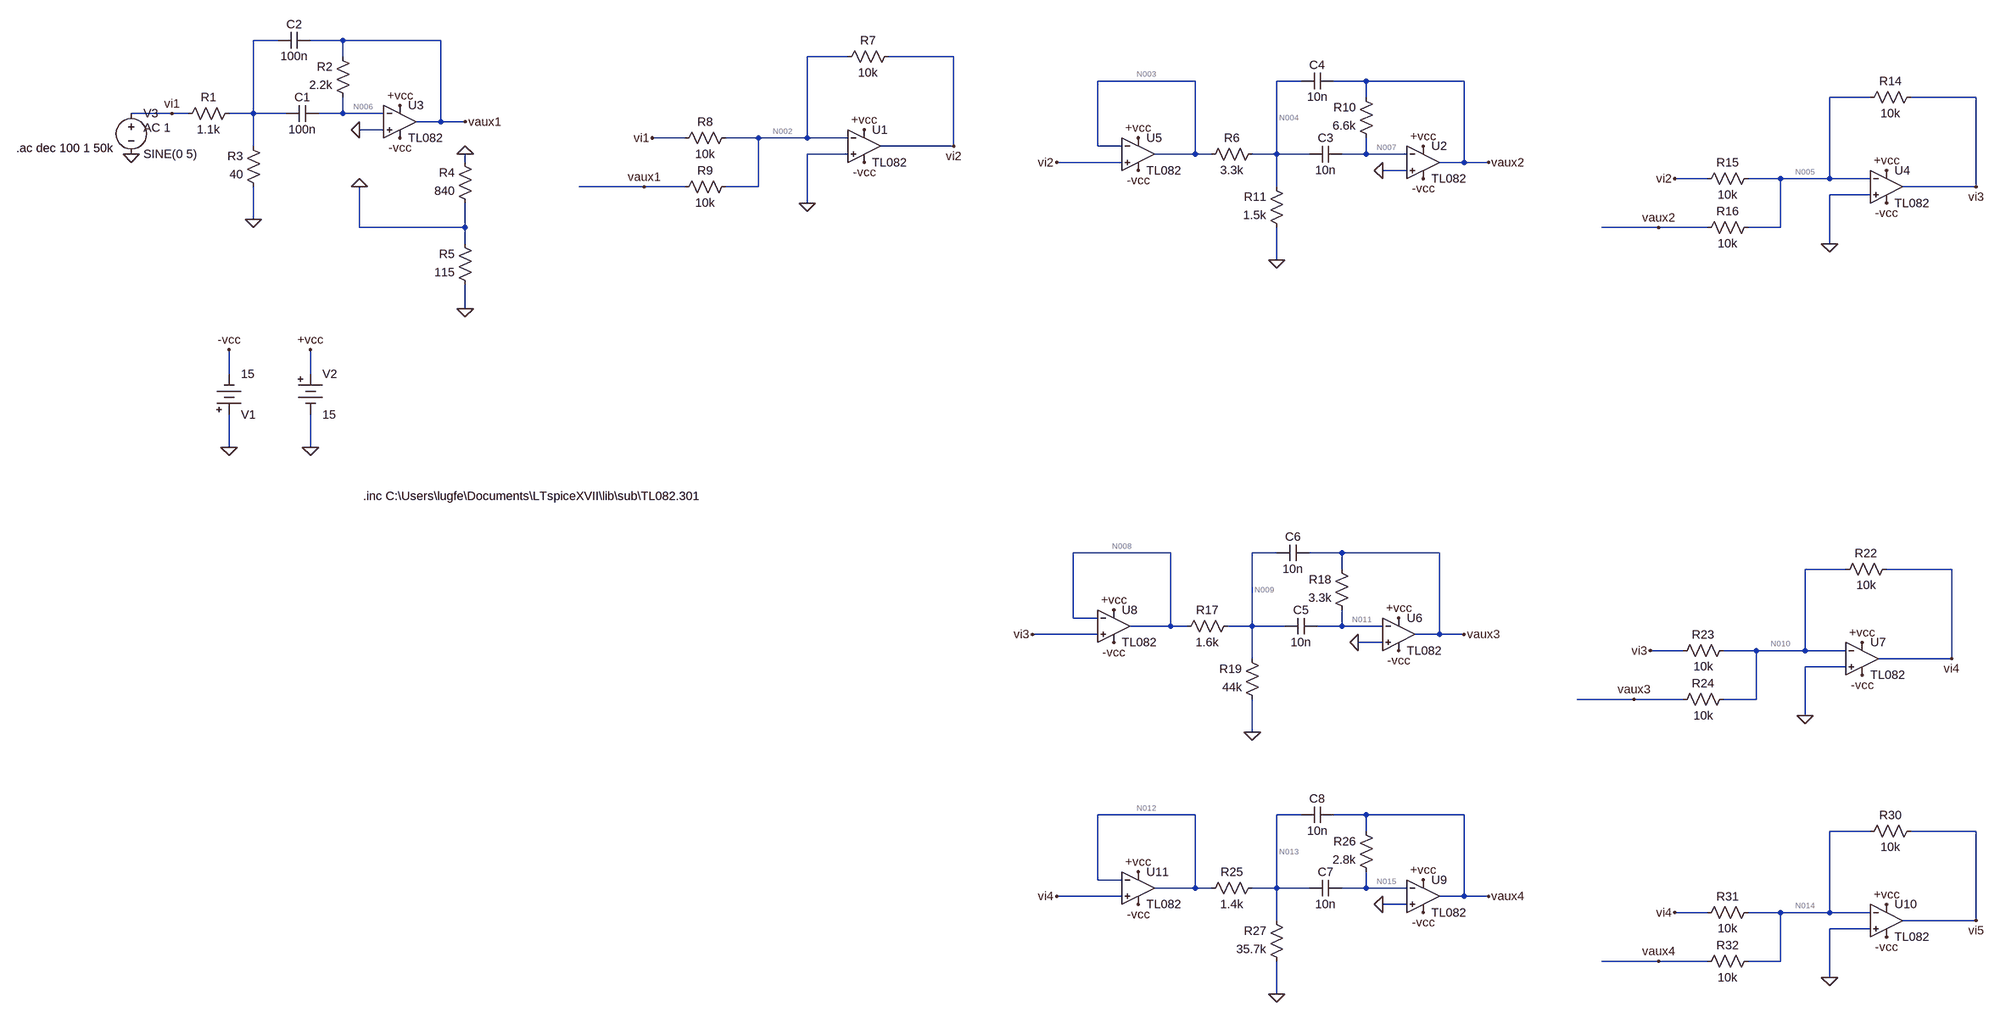
[diagram p0: schematic simulacion.asc]
simulacion.asc, the LTspice schematic file:
Version 4
SHEET 1 3120 2004
WIRE -704 -352 -752 -352
WIRE -576 -352 -640 -352
WIRE -384 -352 -576 -352
WIRE -576 -320 -576 -352
WIRE 416 -320 336 -320
WIRE 624 -320 496 -320
WIRE 1552 -272 1360 -272
WIRE 1760 -272 1712 -272
WIRE 1888 -272 1824 -272
WIRE 2080 -272 1888 -272
WIRE 1888 -240 1888 -272
WIRE 2880 -240 2800 -240
WIRE 3088 -240 2960 -240
WIRE -912 -208 -992 -208
WIRE -880 -208 -912 -208
WIRE -752 -208 -752 -352
WIRE -752 -208 -800 -208
WIRE -688 -208 -752 -208
WIRE -576 -208 -576 -240
WIRE -576 -208 -624 -208
WIRE -496 -208 -576 -208
WIRE -384 -192 -384 -352
WIRE -384 -192 -432 -192
WIRE -336 -192 -384 -192
WIRE -496 -176 -544 -176
WIRE 96 -160 32 -160
WIRE 240 -160 176 -160
WIRE 336 -160 336 -320
WIRE 336 -160 240 -160
WIRE 416 -160 336 -160
WIRE -752 -144 -752 -208
WIRE 624 -144 624 -320
WIRE 624 -144 480 -144
WIRE 1360 -144 1360 -272
WIRE 1408 -144 1360 -144
WIRE 416 -128 336 -128
WIRE 1552 -128 1552 -272
WIRE 1552 -128 1472 -128
WIRE 1584 -128 1552 -128
WIRE 1712 -128 1712 -272
WIRE 1712 -128 1664 -128
WIRE 1776 -128 1712 -128
WIRE 1888 -128 1888 -160
WIRE 1888 -128 1840 -128
WIRE 1968 -128 1888 -128
WIRE -336 -112 -336 -128
WIRE 1408 -112 1280 -112
WIRE 2080 -112 2080 -272
WIRE 2080 -112 2032 -112
WIRE 2128 -112 2080 -112
WIRE 1968 -96 1920 -96
WIRE 2560 -80 2496 -80
WIRE 2704 -80 2640 -80
WIRE 2800 -80 2800 -240
WIRE 2800 -80 2704 -80
WIRE 2880 -80 2800 -80
WIRE 16 -64 -112 -64
WIRE 96 -64 16 -64
WIRE 240 -64 240 -160
WIRE 240 -64 176 -64
WIRE 1712 -64 1712 -128
WIRE 3088 -64 3088 -240
WIRE 3088 -64 2944 -64
WIRE 2880 -48 2800 -48
WIRE 336 -32 336 -128
WIRE -752 0 -752 -64
WIRE -544 16 -544 -64
WIRE -336 16 -336 -32
WIRE -336 16 -544 16
WIRE 2464 16 2352 16
WIRE 2560 16 2464 16
WIRE 2704 16 2704 -80
WIRE 2704 16 2640 16
WIRE -336 48 -336 16
WIRE 2800 48 2800 -48
WIRE 1712 80 1712 16
WIRE -336 176 -336 128
WIRE -800 304 -800 256
WIRE -640 304 -640 256
WIRE -800 448 -800 384
WIRE -640 448 -640 384
WIRE 1504 656 1312 656
WIRE 1712 656 1664 656
WIRE 1840 656 1776 656
WIRE 2032 656 1840 656
WIRE 1840 688 1840 656
WIRE 2832 688 2752 688
WIRE 3040 688 2912 688
WIRE 1312 784 1312 656
WIRE 1360 784 1312 784
WIRE 1504 800 1504 656
WIRE 1504 800 1424 800
WIRE 1536 800 1504 800
WIRE 1664 800 1664 656
WIRE 1664 800 1616 800
WIRE 1728 800 1664 800
WIRE 1840 800 1840 768
WIRE 1840 800 1792 800
WIRE 1920 800 1840 800
WIRE 1360 816 1232 816
WIRE 2032 816 2032 656
WIRE 2032 816 1984 816
WIRE 2080 816 2032 816
WIRE 1920 832 1872 832
WIRE 2512 848 2448 848
WIRE 2656 848 2592 848
WIRE 2752 848 2752 688
WIRE 2752 848 2656 848
WIRE 2832 848 2752 848
WIRE 1664 864 1664 800
WIRE 3040 864 3040 688
WIRE 3040 864 2896 864
WIRE 2832 880 2752 880
WIRE 2416 944 2304 944
WIRE 2512 944 2416 944
WIRE 2656 944 2656 848
WIRE 2656 944 2592 944
WIRE 2752 976 2752 880
WIRE 1664 1008 1664 944
WIRE 1552 1456 1360 1456
WIRE 1760 1456 1712 1456
WIRE 1888 1456 1824 1456
WIRE 2080 1456 1888 1456
WIRE 1888 1488 1888 1456
WIRE 2880 1488 2800 1488
WIRE 3088 1488 2960 1488
WIRE 1360 1584 1360 1456
WIRE 1408 1584 1360 1584
WIRE 1552 1600 1552 1456
WIRE 1552 1600 1472 1600
WIRE 1584 1600 1552 1600
WIRE 1712 1600 1712 1456
WIRE 1712 1600 1664 1600
WIRE 1776 1600 1712 1600
WIRE 1888 1600 1888 1568
WIRE 1888 1600 1840 1600
WIRE 1968 1600 1888 1600
WIRE 1408 1616 1280 1616
WIRE 2080 1616 2080 1456
WIRE 2080 1616 2032 1616
WIRE 2128 1616 2080 1616
WIRE 1968 1632 1920 1632
WIRE 2560 1648 2496 1648
WIRE 2704 1648 2640 1648
WIRE 2800 1648 2800 1488
WIRE 2800 1648 2704 1648
WIRE 2880 1648 2800 1648
WIRE 1712 1664 1712 1600
WIRE 3088 1664 3088 1488
WIRE 3088 1664 2944 1664
WIRE 2880 1680 2800 1680
WIRE 2464 1744 2352 1744
WIRE 2560 1744 2464 1744
WIRE 2704 1744 2704 1648
WIRE 2704 1744 2640 1744
WIRE 2800 1776 2800 1680
WIRE 1712 1808 1712 1744
FLAG -640 256 +vcc
FLAG -640 448 0
FLAG -800 256 -vcc
FLAG -800 448 0
FLAG -336 176 0
FLAG -752 0 0
FLAG -992 -128 0
FLAG -464 -160 -vcc
FLAG -464 -224 +vcc
FLAG -336 -192 vaux1
FLAG -912 -208 vi1
FLAG 336 -32 0
FLAG 448 -112 -vcc
FLAG 448 -176 +vcc
FLAG 32 -160 vi1
FLAG -544 -64 0
FLAG -336 -128 0
FLAG -544 -176 0
FLAG 16 -64 vaux1
FLAG 1712 80 0
FLAG 2000 -80 -vcc
FLAG 2000 -144 +vcc
FLAG 2800 48 0
FLAG 2912 -32 -vcc
FLAG 2912 -96 +vcc
FLAG 1920 -96 0
FLAG 1440 -96 -vcc
FLAG 1440 -160 +vcc
FLAG 1280 -112 vi2
FLAG 2496 -80 vi2
FLAG 2128 -112 vaux2
FLAG 2464 16 vaux2
FLAG 624 -144 vi2
FLAG 3088 -64 vi3
FLAG 1664 1008 0
FLAG 1952 848 -vcc
FLAG 1952 784 +vcc
FLAG 2752 976 0
FLAG 2864 896 -vcc
FLAG 2864 832 +vcc
FLAG 1872 832 0
FLAG 1392 832 -vcc
FLAG 1392 768 +vcc
FLAG 1232 816 vi3
FLAG 2448 848 vi3
FLAG 2080 816 vaux3
FLAG 2416 944 vaux3
FLAG 3040 864 vi4
FLAG 1712 1808 0
FLAG 2000 1648 -vcc
FLAG 2000 1584 +vcc
FLAG 2800 1776 0
FLAG 2912 1696 -vcc
FLAG 2912 1632 +vcc
FLAG 1920 1632 0
FLAG 1440 1632 -vcc
FLAG 1440 1568 +vcc
FLAG 1280 1616 vi4
FLAG 2496 1648 vi4
FLAG 2128 1616 vaux4
FLAG 2464 1744 vaux4
FLAG 3088 1664 vi5
SYMBOL Misc\\battery -640 288 R0
WINDOW 123 0 0 Left 0
WINDOW 39 0 0 Left 0
SYMATTR InstName V2
SYMATTR Value 15
SYMBOL Misc\\battery -800 400 M180
WINDOW 123 0 0 Left 0
WINDOW 39 0 0 Left 0
SYMATTR InstName V1
SYMATTR Value 15
SYMBOL Opamps\\opamp2 -464 -256 R0
SYMATTR InstName U3
SYMATTR Value TL082
SYMBOL cap -624 -224 R90
WINDOW 0 0 32 VBottom 2
WINDOW 3 32 32 VTop 2
SYMATTR InstName C1
SYMATTR Value 100n
SYMBOL cap -640 -368 R90
WINDOW 0 0 32 VBottom 2
WINDOW 3 32 32 VTop 2
SYMATTR InstName C2
SYMATTR Value 100n
SYMBOL res -784 -224 R90
WINDOW 0 0 56 VBottom 2
WINDOW 3 32 56 VTop 2
SYMATTR InstName R1
SYMATTR Value 1.1k
SYMBOL res -560 -224 R180
WINDOW 0 36 76 Left 2
WINDOW 3 36 40 Left 2
SYMATTR InstName R2
SYMATTR Value 2.2k
SYMBOL res -736 -48 R180
WINDOW 0 36 76 Left 2
WINDOW 3 36 40 Left 2
SYMATTR InstName R3
SYMATTR Value 40
SYMBOL res -320 -16 R180
WINDOW 0 36 76 Left 2
WINDOW 3 36 40 Left 2
SYMATTR InstName R4
SYMATTR Value 840
SYMBOL res -320 144 R180
WINDOW 0 36 76 Left 2
WINDOW 3 36 40 Left 2
SYMATTR InstName R5
SYMATTR Value 115
SYMBOL voltage -992 -224 R0
WINDOW 123 24 44 Left 2
WINDOW 39 0 0 Left 0
SYMATTR InstName V3
SYMATTR Value SINE(0 5)
SYMATTR Value2 AC 1
SYMBOL Opamps\\opamp2 448 -208 R0
SYMATTR InstName U1
SYMATTR Value TL082
SYMBOL res 512 -336 R90
WINDOW 0 0 56 VBottom 2
WINDOW 3 32 56 VTop 2
SYMATTR InstName R7
SYMATTR Value 10k
SYMBOL res 192 -176 R90
WINDOW 0 0 56 VBottom 2
WINDOW 3 32 56 VTop 2
SYMATTR InstName R8
SYMATTR Value 10k
SYMBOL res 192 -80 R90
WINDOW 0 0 56 VBottom 2
WINDOW 3 32 56 VTop 2
SYMATTR InstName R9
SYMATTR Value 10k
SYMBOL Opamps\\opamp2 2000 -176 R0
SYMATTR InstName U2
SYMATTR Value TL082
SYMBOL cap 1840 -144 R90
WINDOW 0 0 32 VBottom 2
WINDOW 3 32 32 VTop 2
SYMATTR InstName C3
SYMATTR Value 10n
SYMBOL cap 1824 -288 R90
WINDOW 0 0 32 VBottom 2
WINDOW 3 32 32 VTop 2
SYMATTR InstName C4
SYMATTR Value 10n
SYMBOL res 1680 -144 R90
WINDOW 0 0 56 VBottom 2
WINDOW 3 32 56 VTop 2
SYMATTR InstName R6
SYMATTR Value 3.3k
SYMBOL res 1904 -144 R180
WINDOW 0 36 76 Left 2
WINDOW 3 36 40 Left 2
SYMATTR InstName R10
SYMATTR Value 6.6k
SYMBOL res 1728 32 R180
WINDOW 0 36 76 Left 2
WINDOW 3 36 40 Left 2
SYMATTR InstName R11
SYMATTR Value 1.5k
SYMBOL Opamps\\opamp2 2912 -128 R0
SYMATTR InstName U4
SYMATTR Value TL082
SYMBOL res 2976 -256 R90
WINDOW 0 0 56 VBottom 2
WINDOW 3 32 56 VTop 2
SYMATTR InstName R14
SYMATTR Value 10k
SYMBOL res 2656 -96 R90
WINDOW 0 0 56 VBottom 2
WINDOW 3 32 56 VTop 2
SYMATTR InstName R15
SYMATTR Value 10k
SYMBOL res 2656 0 R90
WINDOW 0 0 56 VBottom 2
WINDOW 3 32 56 VTop 2
SYMATTR InstName R16
SYMATTR Value 10k
SYMBOL Opamps\\opamp2 1440 -192 R0
SYMATTR InstName U5
SYMATTR Value TL082
SYMBOL Opamps\\opamp2 1952 752 R0
SYMATTR InstName U6
SYMATTR Value TL082
SYMBOL cap 1792 784 R90
WINDOW 0 0 32 VBottom 2
WINDOW 3 32 32 VTop 2
SYMATTR InstName C5
SYMATTR Value 10n
SYMBOL cap 1776 640 R90
WINDOW 0 0 32 VBottom 2
WINDOW 3 32 32 VTop 2
SYMATTR InstName C6
SYMATTR Value 10n
SYMBOL res 1632 784 R90
WINDOW 0 0 56 VBottom 2
WINDOW 3 32 56 VTop 2
SYMATTR InstName R17
SYMATTR Value 1.6k
SYMBOL res 1856 784 R180
WINDOW 0 36 76 Left 2
WINDOW 3 36 40 Left 2
SYMATTR InstName R18
SYMATTR Value 3.3k
SYMBOL res 1680 960 R180
WINDOW 0 36 76 Left 2
WINDOW 3 36 40 Left 2
SYMATTR InstName R19
SYMATTR Value 44k
SYMBOL Opamps\\opamp2 2864 800 R0
SYMATTR InstName U7
SYMATTR Value TL082
SYMBOL res 2928 672 R90
WINDOW 0 0 56 VBottom 2
WINDOW 3 32 56 VTop 2
SYMATTR InstName R22
SYMATTR Value 10k
SYMBOL res 2608 832 R90
WINDOW 0 0 56 VBottom 2
WINDOW 3 32 56 VTop 2
SYMATTR InstName R23
SYMATTR Value 10k
SYMBOL res 2608 928 R90
WINDOW 0 0 56 VBottom 2
WINDOW 3 32 56 VTop 2
SYMATTR InstName R24
SYMATTR Value 10k
SYMBOL Opamps\\opamp2 1392 736 R0
SYMATTR InstName U8
SYMATTR Value TL082
SYMBOL Opamps\\opamp2 2000 1552 R0
SYMATTR InstName U9
SYMATTR Value TL082
SYMBOL cap 1840 1584 R90
WINDOW 0 0 32 VBottom 2
WINDOW 3 32 32 VTop 2
SYMATTR InstName C7
SYMATTR Value 10n
SYMBOL cap 1824 1440 R90
WINDOW 0 0 32 VBottom 2
WINDOW 3 32 32 VTop 2
SYMATTR InstName C8
SYMATTR Value 10n
SYMBOL res 1680 1584 R90
WINDOW 0 0 56 VBottom 2
WINDOW 3 32 56 VTop 2
SYMATTR InstName R25
SYMATTR Value 1.4k
SYMBOL res 1904 1584 R180
WINDOW 0 36 76 Left 2
WINDOW 3 36 40 Left 2
SYMATTR InstName R26
SYMATTR Value 2.8k
SYMBOL res 1728 1760 R180
WINDOW 0 36 76 Left 2
WINDOW 3 36 40 Left 2
SYMATTR InstName R27
SYMATTR Value 35.7k
SYMBOL Opamps\\opamp2 2912 1600 R0
SYMATTR InstName U10
SYMATTR Value TL082
SYMBOL res 2976 1472 R90
WINDOW 0 0 56 VBottom 2
WINDOW 3 32 56 VTop 2
SYMATTR InstName R30
SYMATTR Value 10k
SYMBOL res 2656 1632 R90
WINDOW 0 0 56 VBottom 2
WINDOW 3 32 56 VTop 2
SYMATTR InstName R31
SYMATTR Value 10k
SYMBOL res 2656 1728 R90
WINDOW 0 0 56 VBottom 2
WINDOW 3 32 56 VTop 2
SYMATTR InstName R32
SYMATTR Value 10k
SYMBOL Opamps\\opamp2 1440 1536 R0
SYMATTR InstName U11
SYMATTR Value TL082
TEXT -536 544 Left 2 !.inc C:\\Users\\lugfe\\Documents\\LTspiceXVII\\lib\\sub\\TL082.301
TEXT -1218 -140 Left 2 !.ac dec 100 1 50k

The netlist it stands for:
* simulacion.asc
V2 +vcc 0 15
V1 0 -vcc 15
XU3 0 N006 +vcc -vcc vaux1 TL082  ; pins In+ In- V+ V- OUT
C1 N006 N001 100n
C2 vaux1 N001 100n
R1 N001 vi1 1.1k
R2 N006 vaux1 2.2k
R3 0 N001 40
R4 0 0 840
R5 0 0 115
V3 vi1 0 SINE(0 5) AC 1
XU1 0 N002 +vcc -vcc vi2 TL082  ; pins In+ In- V+ V- OUT
R7 vi2 N002 10k
R8 N002 vi1 10k
R9 N002 vaux1 10k
XU2 0 N007 +vcc -vcc vaux2 TL082  ; pins In+ In- V+ V- OUT
C3 N007 N004 10n
C4 vaux2 N004 10n
R6 N004 N003 3.3k
R10 N007 vaux2 6.6k
R11 0 N004 1.5k
XU4 0 N005 +vcc -vcc vi3 TL082  ; pins In+ In- V+ V- OUT
R14 vi3 N005 10k
R15 N005 vi2 10k
R16 N005 vaux2 10k
XU5 vi2 N003 +vcc -vcc N003 TL082  ; pins In+ In- V+ V- OUT
XU6 0 N011 +vcc -vcc vaux3 TL082  ; pins In+ In- V+ V- OUT
C5 N011 N009 10n
C6 vaux3 N009 10n
R17 N009 N008 1.6k
R18 N011 vaux3 3.3k
R19 0 N009 44k
XU7 0 N010 +vcc -vcc vi4 TL082  ; pins In+ In- V+ V- OUT
R22 vi4 N010 10k
R23 N010 vi3 10k
R24 N010 vaux3 10k
XU8 vi3 N008 +vcc -vcc N008 TL082  ; pins In+ In- V+ V- OUT
XU9 0 N015 +vcc -vcc vaux4 TL082  ; pins In+ In- V+ V- OUT
C7 N015 N013 10n
C8 vaux4 N013 10n
R25 N013 N012 1.4k
R26 N015 vaux4 2.8k
R27 0 N013 35.7k
XU10 0 N014 +vcc -vcc vi5 TL082  ; pins In+ In- V+ V- OUT
R30 vi5 N014 10k
R31 N014 vi4 10k
R32 N014 vaux4 10k
XU11 vi4 N012 +vcc -vcc N012 TL082  ; pins In+ In- V+ V- OUT
.inc C:\Users\lugfe\Documents\LTspiceXVII\lib\sub\TL082.301
.ac dec 100 1 50k
.backanno
.end

* Results of the author's LTspice run, read from the files saved beside the schematic
* Operating Point, zero values left out:
*   V(+vcc) = 15 V
*   V(-vcc) = -15 V
*   V(vaux1) = 11.07 µV
*   V(n006) = 10.97 µV
*   V(vi2) = 22.29 µV
*   V(n002) = 10.97 µV
*   V(vaux2) = 11.27 µV
*   V(n007) = 10.97 µV
*   V(n004) = 10.39 µV
*   V(n003) = 33.26 µV
*   V(vi3) = -197.9 nV
*   V(n005) = 10.97 µV
*   V(vaux3) = 11.12 µV
*   V(n011) = 10.97 µV
*   V(n009) = 10.39 µV
*   V(n008) = 10.77 µV
*   V(vi4) = 22.44 µV
*   V(n010) = 10.97 µV
*   V(vaux4) = 11.1 µV
*   V(n015) = 10.97 µV
*   V(n013) = 32.15 µV
*   V(n012) = 33.41 µV
*   V(vi5) = -175.1 nV
*   V(n014) = 10.97 µV
*   I(R32) = -12.61 pA
*   I(R31) = -1.147 nA
*   I(R30) = -1.115 nA
*   I(R27) = -900.6 pA
*   I(R26) = -45.05 pA
*   I(R25) = -900.6 pA
*   I(R24) = -14.87 pA
*   I(R23) = 1.117 nA
*   I(R22) = 1.147 nA
*   I(R19) = -236.2 pA
*   I(R18) = -45.05 pA
*   I(R17) = -236.2 pA
*   I(R16) = -29.73 pA
*   I(R15) = -1.132 nA
*   I(R14) = -1.117 nA
*   I(R11) = -6.93 nA
*   I(R10) = -45.05 pA
*   I(R6) = -6.93 nA
*   I(R9) = -9.917 pA
*   I(R8) = 1.097 nA
*   I(R7) = 1.132 nA
*   I(R2) = -45.05 pA
*   I(V3) = 1.097 nA
*   I(V1) = -156.1 mA
*   I(V2) = -156.1 mA
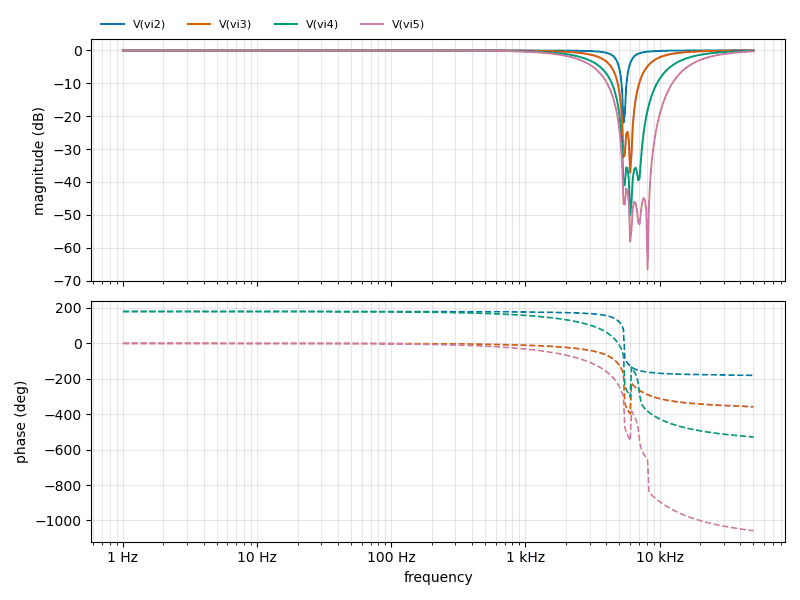
[diagram p1: AC Analysis of simulacion.asc, plotted from the saved traces]
* AC Analysis, 1 run:
*   V(vi2): -0.00 dB at 1 Hz, 0.01 dB at 50 kHz, peak 0.01 dB at 45.71 kHz, 3 dB below the peak at 6.16 kHz
*   V(vi3): -0.00 dB at 1 Hz, -0.01 dB at 50 kHz, peak -0.00 dB at 1 Hz, 3 dB below the peak at 3.896 kHz
*   V(vi4): -0.00 dB at 1 Hz, -0.12 dB at 50 kHz, peak -0.00 dB at 1 Hz, 3 dB below the peak at 3.004 kHz
*   V(vi5): -0.00 dB at 1 Hz, -0.29 dB at 50 kHz, peak -0.00 dB at 1 Hz, 3 dB below the peak at 2.595 kHz